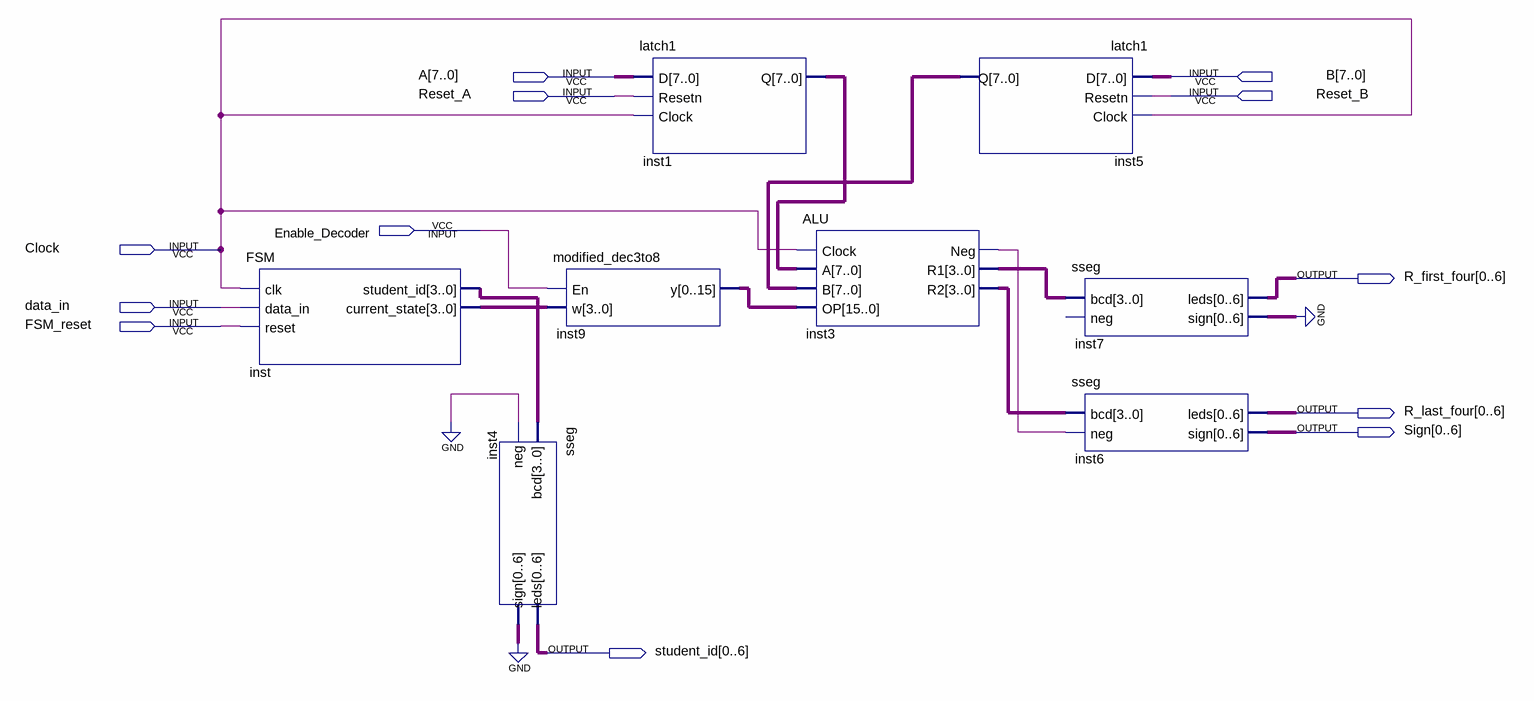
[diagram p0: schematic sheet]
// Quartus schematic block_schematic1.bdf as structural Verilog: 8 symbols, 12 pins
module block_schematic1 (
  input  [7:0] A,
  input  [7:0] B,
  input  Reset_A,
  input  Reset_B,
  input  Enable_Decoder,
  input  Clock,
  input  data_in,
  input  FSM_reset,
  output [0:6] R_first_four,
  output [0:6] R_last_four,
  output [0:6] Sign,
  output [0:6] student_id
);

  wire inst3_neg;
  wire [3:0] inst3_r1, inst3_r2, inst_current_state, inst_student_id;
  wire [6:0] inst4_sign, inst7_sign;
  wire [7:0] inst1_q, inst5_q;
  wire [15:0] inst9_y;

  FSM inst (
    .clk(Clock), .data_in(data_in), .reset(FSM_reset), .student_id(inst_student_id),
    .current_state(inst_current_state));
  sseg inst4 (.bcd(inst_student_id), .neg(1'b0), .leds(student_id), .sign(inst4_sign));
  modified_dec3to8 inst9 (.En(Enable_Decoder), .w(inst_current_state), .y(inst9_y));
  latch1 inst1 (.D(A), .Resetn(Reset_A), .Clock(Clock), .Q(inst1_q));
  ALU inst3 (.Clock(Clock), .A(inst1_q), .B(inst5_q), .OP(inst9_y), .Neg(inst3_neg), .R1(inst3_r1), .R2(inst3_r2));
  latch1 inst5 (.D(B), .Resetn(Reset_B), .Clock(Clock), .Q(inst5_q));
  sseg inst7 (.bcd(inst3_r1), .leds(R_first_four), .sign(inst7_sign));  // open: neg
  sseg inst6 (.bcd(inst3_r2), .neg(inst3_neg), .leds(R_last_four), .sign(Sign));
  // also tied to GND on the sheet: {inst7_sign[0], inst7_sign[1], inst7_sign[2], inst7_sign[3], inst7_sign[4], inst7_sign[5], inst7_sign[6], inst4_sign[0], inst4_sign[1], inst4_sign[2], inst4_sign[3], inst4_sign[4], inst4_sign[5], inst4_sign[6]}
endmodule
